# Vivado block design dpss_vck190_pt, xcvc1902-vsva2197-2MP-e-S, Vivado 2023.2
# (continued, part 2 of 3)
current_bd_instance /dp_rx_hier_0

create_bd_cell -type ip -vlnv xilinx.com:ip:axi_gpio:2.0 axi_gpio_0
set_property -dict {CONFIG.C_ALL_OUTPUTS 1 CONFIG.C_GPIO_WIDTH 2} [get_bd_cells axi_gpio_0]
create_bd_cell -type ip -vlnv xilinx.com:ip:axis_data_fifo:2.0 axis_data_fifo_0
create_bd_cell -type ip -vlnv xilinx.com:ip:axis_switch:1.1 axis_switch_0
set_property -dict {CONFIG.DECODER_REG 1 CONFIG.NUM_MI 2 CONFIG.NUM_SI 1 CONFIG.ROUTING_MODE 1} [get_bd_cells axis_switch_0]
create_bd_cell -type ip -vlnv xilinx.com:ip:i2s_transmitter:1.0 i2s_transmitter_0
set_property -dict {CONFIG.C_DEPTH 1024 CONFIG.C_ENABLE_FIFO_COUNT true} [get_bd_cells i2s_transmitter_0]
create_bd_cell -type ip -vlnv xilinx.com:ip:proc_sys_reset:5.0 proc_sys_reset_0
create_bd_cell -type ip -vlnv xilinx.com:ip:proc_sys_reset:5.0 proc_sys_reset_1
create_bd_cell -type ip -vlnv xilinx.com:ip:proc_sys_reset:5.0 proc_sys_reset_2
create_bd_cell -type ip -vlnv xilinx.com:ip:proc_sys_reset:5.0 proc_sys_reset_3
create_bd_cell -type ip -vlnv xilinx.com:ip:proc_sys_reset:5.0 proc_sys_reset_4
create_bd_cell -type ip -vlnv xilinx.com:ip:audio_clock_recovery_unit:1.0 rx_acr
create_bd_cell -type ip -vlnv xilinx.com:ip:smartconnect:1.0 smartconnect_0
set_property -dict {CONFIG.NUM_CLKS 2 CONFIG.NUM_MI 8 CONFIG.NUM_SI 1} [get_bd_cells smartconnect_0]
create_bd_cell -type ip -vlnv xilinx.com:ip:util_reduced_logic:2.0 util_reduced_logic_0
set_property -dict {CONFIG.C_SIZE 2} [get_bd_cells util_reduced_logic_0]
create_bd_cell -type ip -vlnv xilinx.com:ip:util_vector_logic:2.0 util_vector_logic_1
set_property -dict {CONFIG.C_OPERATION not CONFIG.C_SIZE 1} [get_bd_cells util_vector_logic_1]
create_bd_cell -type ip -vlnv xilinx.com:ip:v_frmbuf_wr:2.5 v_frmbuf_wr_0
set_property -dict [list \
  CONFIG.AXIMM_DATA_WIDTH 256 \
  CONFIG.AXIMM_NUM_OUTSTANDING 8 \
  CONFIG.C_M_AXI_MM_VIDEO_DATA_WIDTH 256 \
  CONFIG.HAS_RGBX10 1 \
  CONFIG.HAS_YUV8 1 \
  CONFIG.HAS_YUVX8 0 \
  CONFIG.HAS_YUVX10 1 \
  CONFIG.HAS_YUYV8 1 \
  CONFIG.HAS_Y_UV10 1 \
  CONFIG.MAX_COLS 7680 \
  CONFIG.MAX_DATA_WIDTH 10 \
  CONFIG.MAX_NR_PLANES 2 \
  CONFIG.MAX_ROWS 4320 \
  CONFIG.SAMPLES_PER_CLOCK 4 \
] [get_bd_cells v_frmbuf_wr_0]
create_bd_cell -type ip -vlnv xilinx.com:ip:vid_edid:1.0 vid_edid_0
create_bd_cell -type ip -vlnv xilinx.com:ip:video_frame_crc:1.0 video_frame_crc_0
set_property -dict {CONFIG.BPC 10} [get_bd_cells video_frame_crc_0]
create_bd_cell -type ip -vlnv xilinx.com:ip:xlconcat:2.1 xlconcat_0
create_bd_cell -type ip -vlnv xilinx.com:ip:xlslice:1.0 xlslice_0
set_property -dict {CONFIG.DIN_FROM 0 CONFIG.DIN_TO 0 CONFIG.DIN_WIDTH 2} [get_bd_cells xlslice_0]
create_bd_cell -type ip -vlnv xilinx.com:ip:xlslice:1.0 xlslice_1
set_property -dict {CONFIG.DIN_FROM 1 CONFIG.DIN_TO 1 CONFIG.DIN_WIDTH 2 CONFIG.DOUT_WIDTH 1} [get_bd_cells xlslice_1]
create_bd_cell -type ip -vlnv xilinx.com:ip:xlslice:1.0 xlslice_2
set_property -dict {CONFIG.DIN_FROM 11 CONFIG.DIN_TO 0 CONFIG.DIN_WIDTH 16 CONFIG.DOUT_WIDTH 12} [get_bd_cells xlslice_2]
create_bd_cell -type ip -vlnv xilinx.com:ip:xlslice:1.0 xlslice_3
set_property -dict {CONFIG.DIN_FROM 19 CONFIG.DIN_TO 0 CONFIG.DIN_WIDTH 24 CONFIG.DOUT_WIDTH 20} [get_bd_cells xlslice_3]
create_bd_cell -type ip -vlnv xilinx.com:ip:xlslice:1.0 xlslice_4
set_property -dict {CONFIG.DIN_FROM 19 CONFIG.DIN_TO 0 CONFIG.DIN_WIDTH 24 CONFIG.DOUT_WIDTH 20} [get_bd_cells xlslice_4]
create_bd_cell -type ip -vlnv xilinx.com:ip:v_vid_gt_bridge:2.0 dprx_gt_ip0
set_property -dict [list \
  CONFIG.c_enable_rx 1 \
  CONFIG.c_enable_tx 0 \
  CONFIG.c_new_dp 1 \
  CONFIG.c_protocol 0 \
  CONFIG.c_rx_num_ch 4 \
  CONFIG.c_rx_rate 8.1 \
] [get_bd_cells dprx_gt_ip0]
create_bd_cell -type ip -vlnv xilinx.com:ip:v_dp_rxss1:3.1 v_dp_rxss1_0
set_property -dict [list \
  CONFIG.AUDIO_ENABLE 1 \
  CONFIG.AUX_IO_LOC 1 \
  CONFIG.BITS_PER_COLOR 10 \
  CONFIG.C_LINK_RATE 30 \
  CONFIG.ENABLE_8B10B_DEC 1 \
  CONFIG.INCLUDE_AXI_IIC 0 \
  CONFIG.INCLUDE_CLK_WIZ 1 \
  CONFIG.LINK_RATE 8.1 \
] [get_bd_cells v_dp_rxss1_0]

# ---- hierarchy /dp_tx_hier_0 ----
current_bd_instance /dp_tx_hier_0
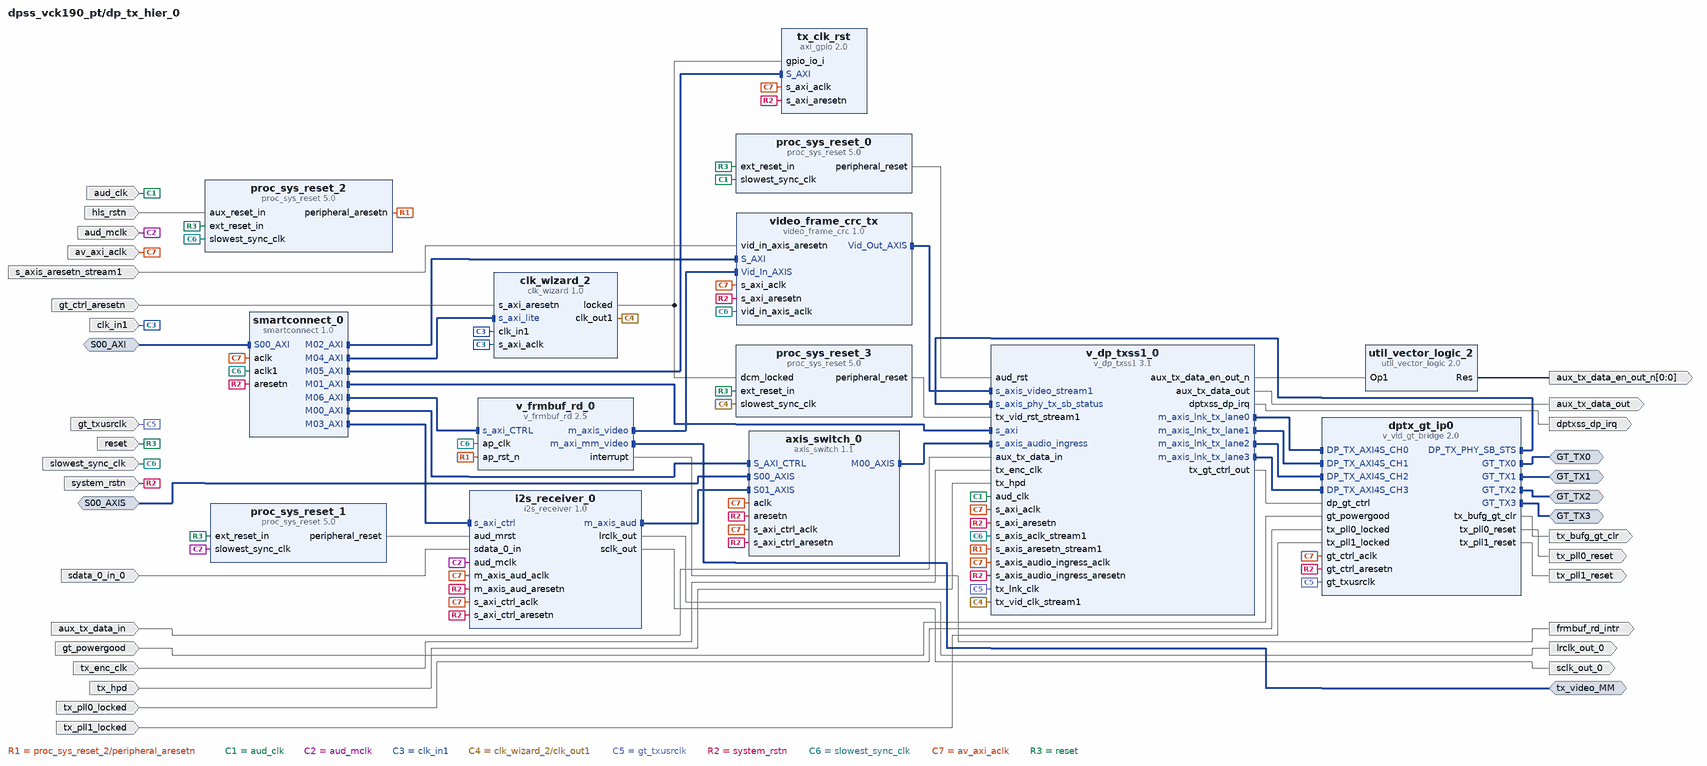
[diagram p3: block diagram inside /dp_tx_hier_0]
create_bd_intf_pin -mode Slave -vlnv xilinx.com:interface:aximm_rtl:1.0 S00_AXI
create_bd_intf_pin -mode Slave -vlnv xilinx.com:interface:axis_rtl:1.0 S00_AXIS
create_bd_intf_pin -mode Master -vlnv xilinx.com:interface:aximm_rtl:1.0 tx_video_MM
create_bd_intf_pin -mode Master -vlnv xilinx.com:interface:gt_tx_interface_rtl:1.0 GT_TX3
create_bd_intf_pin -mode Master -vlnv xilinx.com:interface:gt_tx_interface_rtl:1.0 GT_TX1
create_bd_intf_pin -mode Master -vlnv xilinx.com:interface:gt_tx_interface_rtl:1.0 GT_TX0
create_bd_intf_pin -mode Master -vlnv xilinx.com:interface:gt_tx_interface_rtl:1.0 GT_TX2
create_bd_pin -dir I -type clk aud_clk
create_bd_pin -dir I -type clk aud_mclk
create_bd_pin -dir O -from 0 -to 0 aux_tx_data_en_out_n
create_bd_pin -dir I aux_tx_data_in
create_bd_pin -dir O aux_tx_data_out
create_bd_pin -dir I -type clk av_axi_aclk
create_bd_pin -dir I -type clk clk_in1
create_bd_pin -dir O -type intr dptxss_dp_irq
create_bd_pin -dir O -type intr frmbuf_rd_intr
create_bd_pin -dir I -type rst gt_ctrl_aresetn
create_bd_pin -dir I -type rst hls_rstn
create_bd_pin -dir O lrclk_out_0
create_bd_pin -dir I -type rst reset
create_bd_pin -dir I -type rst s_axis_aresetn_stream1
create_bd_pin -dir O sclk_out_0
create_bd_pin -dir I sdata_0_in_0
create_bd_pin -dir I -type clk slowest_sync_clk
create_bd_pin -dir I -type rst system_rstn
create_bd_pin -dir I -type data tx_hpd
create_bd_pin -dir I tx_pll0_locked
create_bd_pin -dir I gt_powergood
create_bd_pin -dir I -type gt_usrclk gt_txusrclk
create_bd_pin -dir O -type rst tx_pll0_reset
create_bd_pin -dir I tx_pll1_locked
create_bd_pin -dir O tx_bufg_gt_clr
create_bd_pin -dir O -type rst tx_pll1_reset
create_bd_pin -dir I -type clk tx_enc_clk

create_bd_cell -type ip -vlnv xilinx.com:ip:axis_switch:1.1 axis_switch_0
set_property -dict {CONFIG.ROUTING_MODE 1} [get_bd_cells axis_switch_0]
create_bd_cell -type ip -vlnv xilinx.com:ip:clk_wizard:1.0 clk_wizard_2
set_property -dict [list \
  CONFIG.CLKOUT_DRIVES BUFG,BUFG,BUFG,BUFG,BUFG,BUFG,BUFG \
  CONFIG.CLKOUT_DYN_PS None,None,None,None,None,None,None \
  CONFIG.CLKOUT_GROUPING Auto,Auto,Auto,Auto,Auto,Auto,Auto \
  CONFIG.CLKOUT_MATCHED_ROUTING false,false,false,false,false,false,false \
  CONFIG.CLKOUT_MBUFGCE_MODE PERFORMANCE,PERFORMANCE,PERFORMANCE,PERFORMANCE,PERFORMANCE,PERFORMANCE,PERFORMANCE \
  CONFIG.CLKOUT_PORT clk_out1,clk_out2,clk_out3,clk_out4,clk_out5,clk_out6,clk_out7 \
  CONFIG.CLKOUT_REQUESTED_DUTY_CYCLE 50.000,50.000,50.000,50.000,50.000,50.000,50.000 \
  CONFIG.CLKOUT_REQUESTED_OUT_FREQUENCY 300,100.000,100.000,100.000,100.000,100.000,100.000 \
  CONFIG.CLKOUT_REQUESTED_PHASE 0.000,0.000,0.000,0.000,0.000,0.000,0.000 \
  CONFIG.CLKOUT_USED true,false,false,false,false,false,false \
  CONFIG.PRIM_SOURCE No_buffer \
  CONFIG.USE_DYN_RECONFIG true \
] [get_bd_cells clk_wizard_2]
create_bd_cell -type ip -vlnv xilinx.com:ip:i2s_receiver:1.0 i2s_receiver_0
create_bd_cell -type ip -vlnv xilinx.com:ip:proc_sys_reset:5.0 proc_sys_reset_0
create_bd_cell -type ip -vlnv xilinx.com:ip:proc_sys_reset:5.0 proc_sys_reset_1
create_bd_cell -type ip -vlnv xilinx.com:ip:proc_sys_reset:5.0 proc_sys_reset_2
create_bd_cell -type ip -vlnv xilinx.com:ip:proc_sys_reset:5.0 proc_sys_reset_3
create_bd_cell -type ip -vlnv xilinx.com:ip:smartconnect:1.0 smartconnect_0
set_property -dict {CONFIG.NUM_CLKS 2 CONFIG.NUM_MI 7 CONFIG.NUM_SI 1} [get_bd_cells smartconnect_0]
create_bd_cell -type ip -vlnv xilinx.com:ip:axi_gpio:2.0 tx_clk_rst
set_property -dict [list \
  CONFIG.C_ALL_INPUTS 1 \
  CONFIG.C_ALL_OUTPUTS_2 1 \
  CONFIG.C_DOUT_DEFAULT_2 0x0000000f \
  CONFIG.C_GPIO2_WIDTH 1 \
  CONFIG.C_GPIO_WIDTH 1 \
  CONFIG.C_IS_DUAL 1 \
] [get_bd_cells tx_clk_rst]
create_bd_cell -type ip -vlnv xilinx.com:ip:util_vector_logic:2.0 util_vector_logic_2
set_property -dict {CONFIG.C_OPERATION not CONFIG.C_SIZE 1} [get_bd_cells util_vector_logic_2]
create_bd_cell -type ip -vlnv xilinx.com:ip:v_frmbuf_rd:2.5 v_frmbuf_rd_0
set_property -dict [list \
  CONFIG.AXIMM_DATA_WIDTH 256 \
  CONFIG.AXIMM_NUM_OUTSTANDING 8 \
  CONFIG.C_M_AXI_MM_VIDEO_DATA_WIDTH 256 \
  CONFIG.HAS_RGBX10 1 \
  CONFIG.HAS_YUV8 1 \
  CONFIG.HAS_YUVX8 0 \
  CONFIG.HAS_YUVX10 1 \
  CONFIG.HAS_YUYV8 1 \
  CONFIG.HAS_Y_UV10 1 \
  CONFIG.MAX_COLS 7680 \
  CONFIG.MAX_DATA_WIDTH 10 \
  CONFIG.MAX_NR_PLANES 2 \
  CONFIG.MAX_ROWS 4320 \
  CONFIG.SAMPLES_PER_CLOCK 4 \
] [get_bd_cells v_frmbuf_rd_0]
create_bd_cell -type ip -vlnv xilinx.com:ip:video_frame_crc:1.0 video_frame_crc_tx
set_property -dict {CONFIG.BPC 10} [get_bd_cells video_frame_crc_tx]
create_bd_cell -type ip -vlnv xilinx.com:ip:v_vid_gt_bridge:2.0 dptx_gt_ip0
set_property -dict [list \
  CONFIG.c_enable_tx 1 \
  CONFIG.c_new_dp 1 \
  CONFIG.c_protocol 0 \
  CONFIG.c_tx_num_ch 4 \
  CONFIG.c_tx_rate 8.1 \
] [get_bd_cells dptx_gt_ip0]
create_bd_cell -type ip -vlnv xilinx.com:ip:v_dp_txss1:3.1 v_dp_txss1_0
set_property -dict [list \
  CONFIG.AUDIO_ENABLE 1 \
  CONFIG.AUX_IO_LOC 1 \
  CONFIG.BITS_PER_COLOR 10 \
  CONFIG.C_LINK_RATE 30 \
  CONFIG.ENABLE_8B10B_ENC 1 \
  CONFIG.LINK_RATE 8.1 \
] [get_bd_cells v_dp_txss1_0]

# ---- hierarchy /processor_hier_0 ----
current_bd_instance /processor_hier_0
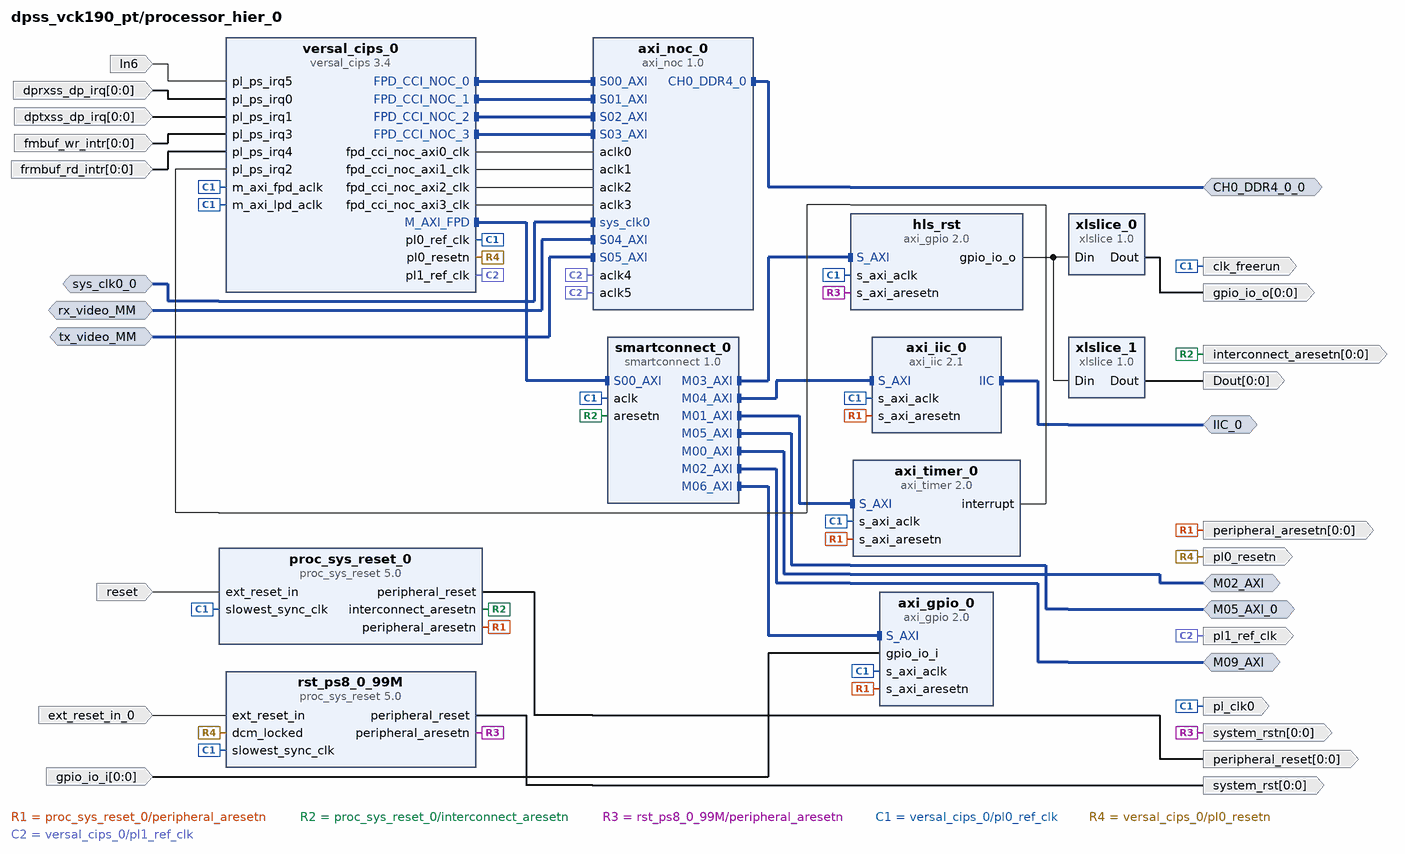
[diagram p4: block diagram inside /processor_hier_0]
create_bd_intf_pin -mode Master -vlnv xilinx.com:interface:ddr4_rtl:1.0 CH0_DDR4_0_0
create_bd_intf_pin -mode Master -vlnv xilinx.com:interface:iic_rtl:1.0 IIC_0
create_bd_intf_pin -mode Master -vlnv xilinx.com:interface:aximm_rtl:1.0 M02_AXI
create_bd_intf_pin -mode Master -vlnv xilinx.com:interface:aximm_rtl:1.0 M05_AXI_0
create_bd_intf_pin -mode Master -vlnv xilinx.com:interface:aximm_rtl:1.0 M09_AXI
create_bd_intf_pin -mode Slave -vlnv xilinx.com:interface:aximm_rtl:1.0 rx_video_MM
create_bd_intf_pin -mode Slave -vlnv xilinx.com:interface:diff_clock_rtl:1.0 sys_clk0_0
create_bd_intf_pin -mode Slave -vlnv xilinx.com:interface:aximm_rtl:1.0 tx_video_MM
create_bd_pin -dir O -from 0 -to 0 Dout
create_bd_pin -dir I -type intr In6
create_bd_pin -dir O -type clk clk_freerun
create_bd_pin -dir I -from 0 -to 0 dprxss_dp_irq
create_bd_pin -dir I -from 0 -to 0 dptxss_dp_irq
create_bd_pin -dir I -type rst ext_reset_in_0
create_bd_pin -dir I -from 0 -to 0 fmbuf_wr_intr
create_bd_pin -dir I -from 0 -to 0 frmbuf_rd_intr
create_bd_pin -dir O -from 0 -to 0 gpio_io_o
create_bd_pin -dir O -from 0 -to 0 -type rst interconnect_aresetn
create_bd_pin -dir O -from 0 -to 0 -type rst peripheral_aresetn
create_bd_pin -dir O -from 0 -to 0 -type rst peripheral_reset
create_bd_pin -dir O -type rst pl0_resetn
create_bd_pin -dir O -type clk pl1_ref_clk
create_bd_pin -dir O -type clk pl_clk0
create_bd_pin -dir I -type rst reset
create_bd_pin -dir O -from 0 -to 0 -type rst system_rst
create_bd_pin -dir O -from 0 -to 0 -type rst system_rstn
create_bd_pin -dir I -from 0 -to 0 gpio_io_i

create_bd_cell -type ip -vlnv xilinx.com:ip:axi_iic:2.1 axi_iic_0
create_bd_cell -type ip -vlnv xilinx.com:ip:axi_noc:1.0 axi_noc_0
set_property -dict [list \
  CONFIG.CH0_DDR4_0_BOARD_INTERFACE ddr4_dimm1 \
  CONFIG.MC_SYSTEM_CLOCK Differential \
  CONFIG.NUM_CLKS 6 \
  CONFIG.NUM_MC 1 \
  CONFIG.NUM_MCP 4 \
  CONFIG.NUM_MI 0 \
  CONFIG.NUM_SI 6 \
  CONFIG.sys_clk0_BOARD_INTERFACE ddr4_dimm1_sma_clk \
] [get_bd_cells axi_noc_0]
create_bd_cell -type ip -vlnv xilinx.com:ip:axi_timer:2.0 axi_timer_0
create_bd_cell -type ip -vlnv xilinx.com:ip:axi_gpio:2.0 hls_rst
set_property -dict {CONFIG.C_ALL_OUTPUTS 1 CONFIG.C_DOUT_DEFAULT 0x0000000f CONFIG.C_GPIO_WIDTH 2} [get_bd_cells hls_rst]
create_bd_cell -type ip -vlnv xilinx.com:ip:proc_sys_reset:5.0 proc_sys_reset_0
create_bd_cell -type ip -vlnv xilinx.com:ip:proc_sys_reset:5.0 rst_ps8_0_99M
create_bd_cell -type ip -vlnv xilinx.com:ip:smartconnect:1.0 smartconnect_0
set_property -dict {CONFIG.NUM_MI 7 CONFIG.NUM_SI 1} [get_bd_cells smartconnect_0]
create_bd_cell -type ip -vlnv xilinx.com:ip:versal_cips:3.4 versal_cips_0
set_property -dict [list \
  CONFIG.CLOCK_MODE Custom \
  CONFIG.DDR_MEMORY_MODE Custom \
  CONFIG.IO_CONFIG_MODE Custom \
  CONFIG.PS_PL_CONNECTIVITY_MODE Custom \
  CONFIG.PS_PMC_CONFIG {['CLOCK_MODE Custom', 'DDR_MEMORY_MODE Custom', 'IO_CONFIG_MODE Custom', 'PMC_CRP_PL0_REF_CTRL_FREQMHZ 100', 'PMC_CRP_PL1_REF_CTRL_FREQMHZ 300', 'PMC_GPIO_EMIO_PERIPHERAL_ENABLE 0', 'PMC_GPIO_EMIO_WIDTH 64', 'PMC_MIO37 {{AUX_IO 0} {DIRECTION out} {DRIVE_STRENGTH 8mA} {OUTPUT_DATA high} {PULL pullup} {SCHMITT 0} {SLEW slow} {USAGE GPIO}}', 'PS_I2C0_PERIPHERAL {{ENABLE 1} {IO {PMC_MIO 46 .. 47}}}', 'PS_I2C1_PERIPHERAL {{ENABLE 1} {IO {PMC_MIO 44 .. 45}}}', 'PS_IRQ_USAGE {{CH0 1} {CH1 1} {CH10 0} {CH11 0} {CH12 0} {CH13 0} {CH14 0} {CH15 0} {CH2 1} {CH3 1} {CH4 1} {CH5 1} {CH6 0} {CH7 0} {CH8 0} {CH9 0}}', 'PS_NUM_FABRIC_RESETS 1', 'PS_PL_CONNECTIVITY_MODE Custom', 'PS_UART0_PERIPHERAL {{ENABLE 1} {IO {PMC_MIO 42 .. 43}}}', 'PS_USE_FPD_CCI_NOC 1', 'PS_USE_M_AXI_FPD 1', 'PS_USE_M_AXI_LPD 1', 'PS_USE_PMCPL_CLK0 1', 'PS_USE_PMCPL_CLK1 1', 'PS_USE_S_AXI_FPD 0', 'PS_USE_S_AXI_LPD 0', 'SMON_ALARMS Set_Alarms_On', 'SMON_ENABLE_TEMP_AVERAGING 0', 'SMON_TEMP_AVERAGING_SAMPLES 0']} \
] [get_bd_cells versal_cips_0]
create_bd_cell -type ip -vlnv xilinx.com:ip:xlslice:1.0 xlslice_0
set_property -dict {CONFIG.DIN_FROM 0 CONFIG.DIN_TO 0 CONFIG.DIN_WIDTH 2} [get_bd_cells xlslice_0]
create_bd_cell -type ip -vlnv xilinx.com:ip:xlslice:1.0 xlslice_1
set_property -dict {CONFIG.DIN_FROM 1 CONFIG.DIN_TO 1 CONFIG.DIN_WIDTH 2 CONFIG.DOUT_WIDTH 1} [get_bd_cells xlslice_1]
create_bd_cell -type ip -vlnv xilinx.com:ip:axi_gpio:2.0 axi_gpio_0
set_property -dict {CONFIG.C_ALL_INPUTS 1 CONFIG.C_GPIO_WIDTH 1} [get_bd_cells axi_gpio_0]

# ---- connections ----

current_bd_instance /gt_quad
connect_bd_intf_net [get_bd_intf_pins gt_quad_base/AXI_LITE] [get_bd_intf_pins AXI_LITE]
connect_bd_intf_net -intf_net dprx_gt_ip0_GT_RX0 [get_bd_intf_pins RX0_GT_IP_Interface] [get_bd_intf_pins gt_quad_base/RX0_GT_IP_Interface]
connect_bd_intf_net -intf_net dprx_gt_ip0_GT_RX1 [get_bd_intf_pins RX1_GT_IP_Interface] [get_bd_intf_pins gt_quad_base/RX1_GT_IP_Interface]
connect_bd_intf_net -intf_net dprx_gt_ip0_GT_RX2 [get_bd_intf_pins RX2_GT_IP_Interface] [get_bd_intf_pins gt_quad_base/RX2_GT_IP_Interface]
connect_bd_intf_net -intf_net dprx_gt_ip0_GT_RX3 [get_bd_intf_pins RX3_GT_IP_Interface] [get_bd_intf_pins gt_quad_base/RX3_GT_IP_Interface]
connect_bd_intf_net [get_bd_intf_pins dprx_gt_ip0_diff_gt_ref_clock] [get_bd_intf_pins util_ds_buf/CLK_IN_D]
connect_bd_intf_net -intf_net dptx_gt_ip0_GT_TX0 [get_bd_intf_pins TX0_GT_IP_Interface] [get_bd_intf_pins gt_quad_base/TX0_GT_IP_Interface]
connect_bd_intf_net -intf_net dptx_gt_ip0_GT_TX1 [get_bd_intf_pins TX1_GT_IP_Interface] [get_bd_intf_pins gt_quad_base/TX1_GT_IP_Interface]
connect_bd_intf_net -intf_net dptx_gt_ip0_GT_TX2 [get_bd_intf_pins TX2_GT_IP_Interface] [get_bd_intf_pins gt_quad_base/TX2_GT_IP_Interface]
connect_bd_intf_net -intf_net dptx_gt_ip0_GT_TX3 [get_bd_intf_pins TX3_GT_IP_Interface] [get_bd_intf_pins gt_quad_base/TX3_GT_IP_Interface]
connect_bd_intf_net [get_bd_intf_pins GT_Serial] [get_bd_intf_pins gt_quad_base/GT_Serial]
connect_bd_net [get_bd_pins bufg_gt_1/usrclk] \
  [get_bd_pins usrclk] [get_bd_pins gt_quad_base/ch1_txusrclk] [get_bd_pins gt_quad_base/ch2_txusrclk] \
  [get_bd_pins gt_quad_base/ch3_txusrclk] [get_bd_pins gt_quad_base/ch0_txusrclk]
connect_bd_net [get_bd_pins bufg_gt/usrclk] \
  [get_bd_pins ch0_rxusrclk] [get_bd_pins gt_quad_base/ch0_rxusrclk] [get_bd_pins gt_quad_base/ch1_rxusrclk] \
  [get_bd_pins gt_quad_base/ch2_rxusrclk] [get_bd_pins gt_quad_base/ch3_rxusrclk]
connect_bd_net -net dprx_gt_ip0_rx_bufg_gt_clr [get_bd_pins gt_bufgtclr] [get_bd_pins bufg_gt/gt_bufgtclr]
connect_bd_net -net dprx_gt_ip0_rx_pll0_reset [get_bd_pins hsclk0_lcpllreset] [get_bd_pins gt_quad_base/hsclk0_lcpllreset]
connect_bd_net -net dprx_gt_ip0_rx_pll1_reset [get_bd_pins hsclk1_lcpllreset] [get_bd_pins gt_quad_base/hsclk1_lcpllreset]
connect_bd_net [get_bd_pins dptx_bufg_gt1/usrclk] [get_bd_pins usrclk1]
connect_bd_net -net dptx_gt_ip0_tx_bufg_gt_clr [get_bd_pins gt_bufgtclr1] [get_bd_pins dptx_bufg_gt1/gt_bufgtclr] [get_bd_pins bufg_gt_1/gt_bufgtclr]
connect_bd_net -net dptx_gt_ip0_tx_pll0_reset [get_bd_pins hsclk0_rpllreset] [get_bd_pins gt_quad_base/hsclk0_rpllreset]
connect_bd_net -net dptx_gt_ip0_tx_pll1_reset [get_bd_pins hsclk1_rpllreset] [get_bd_pins gt_quad_base/hsclk1_rpllreset]
connect_bd_net [get_bd_pins gt_quad_base/ch0_rxoutclk] [get_bd_pins bufg_gt/outclk]
connect_bd_net [get_bd_pins gt_quad_base/ch0_txoutclk] [get_bd_pins bufg_gt_1/outclk]
connect_bd_net [get_bd_pins gt_quad_base/ch1_txoutclk] [get_bd_pins dptx_bufg_gt1/outclk]
connect_bd_net [get_bd_pins gt_quad_base/gtpowergood] [get_bd_pins gtpowergood]
connect_bd_net [get_bd_pins gt_quad_base/hsclk0_lcplllock] [get_bd_pins hsclk0_lcplllock]
connect_bd_net [get_bd_pins gt_quad_base/hsclk0_rplllock] [get_bd_pins hsclk0_rplllock]
connect_bd_net [get_bd_pins gt_quad_base/hsclk1_lcplllock] [get_bd_pins hsclk1_lcplllock]
connect_bd_net [get_bd_pins gt_quad_base/hsclk1_rplllock] [get_bd_pins hsclk1_rplllock]
connect_bd_net [get_bd_pins s_axi_lite_clk] [get_bd_pins gt_quad_base/s_axi_lite_clk]
connect_bd_net [get_bd_pins s_axi_lite_resetn] [get_bd_pins gt_quad_base/s_axi_lite_resetn]
connect_bd_net [get_bd_pins util_ds_buf/IBUF_OUT] [get_bd_pins gt_quad_base/GT_REFCLK0] [get_bd_pins gt_quad_base/GT_REFCLK1]

current_bd_instance /dp_rx_hier_0
connect_bd_intf_net [get_bd_intf_pins dprx_gt_ip0/GT_RX3] [get_bd_intf_pins GT_RX3]
connect_bd_intf_net [get_bd_intf_pins dprx_gt_ip0/GT_RX0] [get_bd_intf_pins GT_RX0]
connect_bd_intf_net [get_bd_intf_pins dprx_gt_ip0/GT_RX1] [get_bd_intf_pins GT_RX1]
connect_bd_intf_net [get_bd_intf_pins dprx_gt_ip0/GT_RX2] [get_bd_intf_pins GT_RX2]
connect_bd_intf_net [get_bd_intf_pins S00_AXI] [get_bd_intf_pins smartconnect_0/S00_AXI]
connect_bd_intf_net [get_bd_intf_pins M_AXIS] [get_bd_intf_pins axis_data_fifo_0/M_AXIS]
connect_bd_intf_net [get_bd_intf_pins axis_data_fifo_0/S_AXIS] [get_bd_intf_pins axis_switch_0/M00_AXIS]
connect_bd_intf_net [get_bd_intf_pins axis_switch_0/M01_AXIS] [get_bd_intf_pins i2s_transmitter_0/s_axis_aud]
connect_bd_intf_net [get_bd_intf_pins dprx_gt_ip0/DP_RX_AXI4S_CH0] [get_bd_intf_pins v_dp_rxss1_0/s_axis_lnk_rx_lane0]
connect_bd_intf_net [get_bd_intf_pins dprx_gt_ip0/DP_RX_AXI4S_CH1] [get_bd_intf_pins v_dp_rxss1_0/s_axis_lnk_rx_lane1]
connect_bd_intf_net [get_bd_intf_pins dprx_gt_ip0/DP_RX_AXI4S_CH2] [get_bd_intf_pins v_dp_rxss1_0/s_axis_lnk_rx_lane2]
connect_bd_intf_net [get_bd_intf_pins dprx_gt_ip0/DP_RX_AXI4S_CH3] [get_bd_intf_pins v_dp_rxss1_0/s_axis_lnk_rx_lane3]
connect_bd_intf_net [get_bd_intf_pins dprx_gt_ip0/DP_RX_PHY_SB_STS] [get_bd_intf_pins v_dp_rxss1_0/s_axis_phy_rx_sb_status]
connect_bd_intf_net [get_bd_intf_pins smartconnect_0/M00_AXI] [get_bd_intf_pins v_dp_rxss1_0/s_axi]
connect_bd_intf_net [get_bd_intf_pins smartconnect_0/M01_AXI] [get_bd_intf_pins video_frame_crc_0/S_AXI]
connect_bd_intf_net [get_bd_intf_pins rx_acr/s_axi_ctrl] [get_bd_intf_pins smartconnect_0/M02_AXI]
connect_bd_intf_net [get_bd_intf_pins smartconnect_0/M03_AXI] [get_bd_intf_pins vid_edid_0/s_axi]
connect_bd_intf_net [get_bd_intf_pins axi_gpio_0/S_AXI] [get_bd_intf_pins smartconnect_0/M04_AXI]
connect_bd_intf_net [get_bd_intf_pins axis_switch_0/S_AXI_CTRL] [get_bd_intf_pins smartconnect_0/M05_AXI]
connect_bd_intf_net [get_bd_intf_pins i2s_transmitter_0/s_axi_ctrl] [get_bd_intf_pins smartconnect_0/M06_AXI]
connect_bd_intf_net [get_bd_intf_pins smartconnect_0/M07_AXI] [get_bd_intf_pins v_frmbuf_wr_0/s_axi_CTRL]
connect_bd_intf_net [get_bd_intf_pins v_dp_rxss1_0/aud_axi_egress] [get_bd_intf_pins axis_switch_0/S00_AXIS]
connect_bd_intf_net [get_bd_intf_pins dprx_gt_ip0/DP_RX_PHY_SB_CTRL] [get_bd_intf_pins v_dp_rxss1_0/m_axis_phy_rx_sb_control]
connect_bd_intf_net [get_bd_intf_pins video_frame_crc_0/Vid_In_AXIS] [get_bd_intf_pins v_dp_rxss1_0/m_axis_video_stream1]
connect_bd_intf_net [get_bd_intf_pins rx_video_MM] [get_bd_intf_pins v_frmbuf_wr_0/m_axi_mm_video]
connect_bd_intf_net [get_bd_intf_pins v_frmbuf_wr_0/s_axis_video] [get_bd_intf_pins video_frame_crc_0/Vid_Out_AXIS]
connect_bd_net [get_bd_pins v_dp_rxss1_0/edid_iic_sda_t] [get_bd_pins vid_edid_0/iic_sda_in] [get_bd_pins xlconcat_0/In1]
connect_bd_net [get_bd_pins aud_mclk] \
  [get_bd_pins i2s_transmitter_0/aud_mclk] [get_bd_pins proc_sys_reset_3/slowest_sync_clk] \
  [get_bd_pins proc_sys_reset_4/slowest_sync_clk] [get_bd_pins rx_acr/aud_mclk]
connect_bd_net -net aux_reset_in_1 [get_bd_pins hls_rstn] [get_bd_pins proc_sys_reset_1/aux_reset_in]
connect_bd_net -net aux_rx_data_in_0_1 [get_bd_pins aux_rx_data_in_0] [get_bd_pins v_dp_rxss1_0/aux_rx_data_in]
connect_bd_net [get_bd_pins axi_gpio_0/gpio_io_o] [get_bd_pins xlslice_0/Din] [get_bd_pins xlslice_1/Din]
connect_bd_net -net ctl_reset_1 [get_bd_pins system_rst] [get_bd_pins vid_edid_0/ctl_reset]
connect_bd_net -net dcm_locked_0_1 [get_bd_pins dcm_locked_0] [get_bd_pins proc_sys_reset_0/dcm_locked] [get_bd_pins proc_sys_reset_1/dcm_locked]
connect_bd_net [get_bd_pins dprx_gt_ip0/rx_bufg_gt_clr] [get_bd_pins rx_bufg_gt_clr]
connect_bd_net [get_bd_pins dprx_gt_ip0/rx_pll0_reset] [get_bd_pins rx_pll0_reset]
connect_bd_net [get_bd_pins dprx_gt_ip0/rx_pll1_reset] [get_bd_pins rx_pll1_reset]
connect_bd_net [get_bd_pins ext_reset_in_0] \
  [get_bd_pins proc_sys_reset_0/ext_reset_in] [get_bd_pins proc_sys_reset_1/ext_reset_in] \
  [get_bd_pins proc_sys_reset_2/ext_reset_in] [get_bd_pins proc_sys_reset_3/ext_reset_in] \
  [get_bd_pins proc_sys_reset_4/ext_reset_in]
connect_bd_net [get_bd_pins gt_powergood] [get_bd_pins dprx_gt_ip0/gt_powergood]
connect_bd_net [get_bd_pins gt_rxusrclk] [get_bd_pins dprx_gt_ip0/gt_rxusrclk] [get_bd_pins v_dp_rxss1_0/rx_lnk_clk]
connect_bd_net [get_bd_pins i2s_transmitter_0/fifo_rdata_count] [get_bd_pins xlslice_2/Din]
connect_bd_net [get_bd_pins i2s_transmitter_0/irq] [get_bd_pins irq]
connect_bd_net [get_bd_pins i2s_transmitter_0/lrclk_out] [get_bd_pins lrclk_out_0]
connect_bd_net [get_bd_pins i2s_transmitter_0/sclk_out] [get_bd_pins sclk_out_0]
connect_bd_net [get_bd_pins i2s_transmitter_0/sdata_0_out] [get_bd_pins sdata_0_out_0]
connect_bd_net [get_bd_pins proc_sys_reset_0/peripheral_aresetn] [get_bd_pins peripheral_aresetn1] [get_bd_pins video_frame_crc_0/vid_in_axis_aresetn]
connect_bd_net [get_bd_pins proc_sys_reset_0/peripheral_reset] [get_bd_pins v_dp_rxss1_0/rx_vid_rst]
connect_bd_net [get_bd_pins proc_sys_reset_1/peripheral_aresetn] [get_bd_pins v_frmbuf_wr_0/ap_rst_n]
connect_bd_net [get_bd_pins proc_sys_reset_2/peripheral_aresetn] [get_bd_pins rx_acr/acr_resetn] [get_bd_pins rx_acr/ref_clk_resetn]
connect_bd_net [get_bd_pins proc_sys_reset_3/peripheral_reset] [get_bd_pins rx_acr/aud_mrst]
connect_bd_net [get_bd_pins proc_sys_reset_4/peripheral_reset] [get_bd_pins i2s_transmitter_0/aud_mrst]
connect_bd_net [get_bd_pins rx_acr/aud_clk_out] [get_bd_pins aud_clk_out_0]
connect_bd_net [get_bd_pins rx_pll0_locked] [get_bd_pins dprx_gt_ip0/rx_pll0_locked]
connect_bd_net -net rx_pll1_locked1_1 [get_bd_pins rx_pll1_locked1] [get_bd_pins dprx_gt_ip0/rx_pll1_locked]
connect_bd_net [get_bd_pins util_reduced_logic_0/Res] [get_bd_pins v_dp_rxss1_0/edid_iic_sda_i]
connect_bd_net [get_bd_pins util_vector_logic_1/Res] [get_bd_pins aux_rx_data_en_out_n_0]
connect_bd_net [get_bd_pins v_dp_rxss1_0/acr_m_aud] [get_bd_pins xlslice_3/Din]
connect_bd_net [get_bd_pins v_dp_rxss1_0/acr_n_aud] [get_bd_pins xlslice_4/Din]
connect_bd_net [get_bd_pins v_dp_rxss1_0/acr_valid] [get_bd_pins rx_acr/acr_valid_in]
connect_bd_net [get_bd_pins v_dp_rxss1_0/aux_rx_data_en_out_n] [get_bd_pins util_vector_logic_1/Op1]
connect_bd_net [get_bd_pins v_dp_rxss1_0/aux_rx_data_out] [get_bd_pins aux_rx_data_out_0]
connect_bd_net [get_bd_pins v_dp_rxss1_0/clkwiz_rx_locked_out] [get_bd_pins dprx_gt_ip0/rx_mmcm_locked]
connect_bd_net [get_bd_pins v_dp_rxss1_0/dprxss_dp_irq] [get_bd_pins dprxss_dp_irq]
connect_bd_net [get_bd_pins v_dp_rxss1_0/edid_iic_scl_t] [get_bd_pins v_dp_rxss1_0/edid_iic_scl_i] [get_bd_pins vid_edid_0/iic_scl_in]
connect_bd_net [get_bd_pins v_dp_rxss1_0/rx_dec_clk_out] \
  [get_bd_pins proc_sys_reset_2/slowest_sync_clk] [get_bd_pins rx_acr/ref_clk] [get_bd_pins rx_acr/acr_clk]
connect_bd_net [get_bd_pins v_dp_rxss1_0/rx_gt_ctrl_out] [get_bd_pins dprx_gt_ip0/dp_gt_ctrl]
connect_bd_net [get_bd_pins v_dp_rxss1_0/rx_hpd] [get_bd_pins rx_hpd]
connect_bd_net [get_bd_pins v_frmbuf_wr_0/interrupt] [get_bd_pins fmbuf_wr_intr]
connect_bd_net [get_bd_pins vid_edid_0/iic_sda_out] [get_bd_pins xlconcat_0/In0]
connect_bd_net -net vid_phy_axi4lite_aresetn_1 [get_bd_pins system_rstn] \
  [get_bd_pins axi_gpio_0/s_axi_aresetn] [get_bd_pins axis_switch_0/aresetn] [get_bd_pins axis_switch_0/s_axi_ctrl_aresetn] \
  [get_bd_pins i2s_transmitter_0/s_axi_ctrl_aresetn] [get_bd_pins i2s_transmitter_0/s_axis_aud_aresetn] \
  [get_bd_pins rx_acr/s_axi_ctrl_aresetn] [get_bd_pins smartconnect_0/aresetn] [get_bd_pins vid_edid_0/s_axi_aresetn] \
  [get_bd_pins video_frame_crc_0/s_axi_aresetn] [get_bd_pins dprx_gt_ip0/gt_ctrl_aresetn] \
  [get_bd_pins v_dp_rxss1_0/s_axi_aresetn] [get_bd_pins v_dp_rxss1_0/m_aud_axis_aresetn]
connect_bd_net [get_bd_pins xlconcat_0/dout] [get_bd_pins util_reduced_logic_0/Op1]
connect_bd_net [get_bd_pins xlslice_0/Dout] [get_bd_pins Dout]
connect_bd_net [get_bd_pins xlslice_1/Dout] [get_bd_pins axis_data_fifo_0/s_axis_aresetn] [get_bd_pins proc_sys_reset_4/aux_reset_in]
connect_bd_net [get_bd_pins xlslice_2/Dout] [get_bd_pins rx_acr/fifo_datacount_in]
connect_bd_net [get_bd_pins xlslice_3/Dout] [get_bd_pins rx_acr/acr_n_in]
connect_bd_net [get_bd_pins xlslice_4/Dout] [get_bd_pins rx_acr/acr_cts_in]
connect_bd_net -net zynq_ultra_ps_e_0_pl_clk0 [get_bd_pins system_clk] \
  [get_bd_pins axi_gpio_0/s_axi_aclk] [get_bd_pins axis_data_fifo_0/s_axis_aclk] [get_bd_pins axis_switch_0/aclk] \
  [get_bd_pins axis_switch_0/s_axi_ctrl_aclk] [get_bd_pins i2s_transmitter_0/s_axi_ctrl_aclk] \
  [get_bd_pins i2s_transmitter_0/s_axis_aud_aclk] [get_bd_pins rx_acr/s_axi_ctrl_aclk] [get_bd_pins smartconnect_0/aclk] \
  [get_bd_pins vid_edid_0/ctl_clk] [get_bd_pins vid_edid_0/s_axi_aclk] [get_bd_pins video_frame_crc_0/s_axi_aclk] \
  [get_bd_pins dprx_gt_ip0/gt_ctrl_aclk] [get_bd_pins v_dp_rxss1_0/s_axi_aclk] [get_bd_pins v_dp_rxss1_0/m_aud_axis_aclk]
connect_bd_net -net zynq_ultra_ps_e_0_pl_clk2 [get_bd_pins video_clk_300] \
  [get_bd_pins proc_sys_reset_0/slowest_sync_clk] [get_bd_pins proc_sys_reset_1/slowest_sync_clk] \
  [get_bd_pins smartconnect_0/aclk1] [get_bd_pins v_frmbuf_wr_0/ap_clk] [get_bd_pins video_frame_crc_0/vid_in_axis_aclk] \
  [get_bd_pins v_dp_rxss1_0/rx_vid_clk] [get_bd_pins v_dp_rxss1_0/m_axis_aclk_stream1]

current_bd_instance /dp_tx_hier_0
connect_bd_intf_net [get_bd_intf_pins dptx_gt_ip0/GT_TX3] [get_bd_intf_pins GT_TX3]
connect_bd_intf_net [get_bd_intf_pins dptx_gt_ip0/GT_TX1] [get_bd_intf_pins GT_TX1]
connect_bd_intf_net [get_bd_intf_pins dptx_gt_ip0/GT_TX0] [get_bd_intf_pins GT_TX0]
connect_bd_intf_net [get_bd_intf_pins dptx_gt_ip0/GT_TX2] [get_bd_intf_pins GT_TX2]
connect_bd_intf_net [get_bd_intf_pins S00_AXIS] [get_bd_intf_pins axis_switch_0/S00_AXIS]
connect_bd_intf_net [get_bd_intf_pins S00_AXI] [get_bd_intf_pins smartconnect_0/S00_AXI]
connect_bd_intf_net [get_bd_intf_pins axis_switch_0/M00_AXIS] [get_bd_intf_pins v_dp_txss1_0/s_axis_audio_ingress]
connect_bd_intf_net [get_bd_intf_pins dptx_gt_ip0/DP_TX_PHY_SB_STS] [get_bd_intf_pins v_dp_txss1_0/s_axis_phy_tx_sb_status]
connect_bd_intf_net [get_bd_intf_pins axis_switch_0/S01_AXIS] [get_bd_intf_pins i2s_receiver_0/m_axis_aud]
connect_bd_intf_net [get_bd_intf_pins axis_switch_0/S_AXI_CTRL] [get_bd_intf_pins smartconnect_0/M00_AXI]
connect_bd_intf_net [get_bd_intf_pins smartconnect_0/M01_AXI] [get_bd_intf_pins v_dp_txss1_0/s_axi]
connect_bd_intf_net [get_bd_intf_pins smartconnect_0/M02_AXI] [get_bd_intf_pins video_frame_crc_tx/S_AXI]
connect_bd_intf_net [get_bd_intf_pins i2s_receiver_0/s_axi_ctrl] [get_bd_intf_pins smartconnect_0/M03_AXI]
connect_bd_intf_net [get_bd_intf_pins smartconnect_0/M04_AXI] [get_bd_intf_pins clk_wizard_2/s_axi_lite]
connect_bd_intf_net [get_bd_intf_pins smartconnect_0/M05_AXI] [get_bd_intf_pins tx_clk_rst/S_AXI]
connect_bd_intf_net [get_bd_intf_pins smartconnect_0/M06_AXI] [get_bd_intf_pins v_frmbuf_rd_0/s_axi_CTRL]
connect_bd_intf_net [get_bd_intf_pins dptx_gt_ip0/DP_TX_AXI4S_CH0] [get_bd_intf_pins v_dp_txss1_0/m_axis_lnk_tx_lane0]
connect_bd_intf_net [get_bd_intf_pins dptx_gt_ip0/DP_TX_AXI4S_CH1] [get_bd_intf_pins v_dp_txss1_0/m_axis_lnk_tx_lane1]
connect_bd_intf_net [get_bd_intf_pins dptx_gt_ip0/DP_TX_AXI4S_CH2] [get_bd_intf_pins v_dp_txss1_0/m_axis_lnk_tx_lane2]
connect_bd_intf_net [get_bd_intf_pins dptx_gt_ip0/DP_TX_AXI4S_CH3] [get_bd_intf_pins v_dp_txss1_0/m_axis_lnk_tx_lane3]
connect_bd_intf_net [get_bd_intf_pins tx_video_MM] [get_bd_intf_pins v_frmbuf_rd_0/m_axi_mm_video]
connect_bd_intf_net [get_bd_intf_pins v_frmbuf_rd_0/m_axis_video] [get_bd_intf_pins video_frame_crc_tx/Vid_In_AXIS]
connect_bd_intf_net [get_bd_intf_pins v_dp_txss1_0/s_axis_video_stream1] [get_bd_intf_pins video_frame_crc_tx/Vid_Out_AXIS]
connect_bd_net -net ap_rst_n_1 [get_bd_pins proc_sys_reset_2/peripheral_aresetn] \
  [get_bd_pins v_frmbuf_rd_0/ap_rst_n] [get_bd_pins v_dp_txss1_0/s_axis_aresetn_stream1]
connect_bd_net [get_bd_pins aud_clk] [get_bd_pins proc_sys_reset_0/slowest_sync_clk] [get_bd_pins v_dp_txss1_0/aud_clk]
connect_bd_net [get_bd_pins aud_mclk] [get_bd_pins i2s_receiver_0/aud_mclk] [get_bd_pins proc_sys_reset_1/slowest_sync_clk]
connect_bd_net [get_bd_pins aux_tx_data_in] [get_bd_pins v_dp_txss1_0/aux_tx_data_in]
connect_bd_net -net clk_in1_1 [get_bd_pins clk_in1] [get_bd_pins clk_wizard_2/clk_in1] [get_bd_pins clk_wizard_2/s_axi_aclk]
connect_bd_net -net clk_wiz_1_clk_out1 [get_bd_pins clk_wizard_2/clk_out1] \
  [get_bd_pins proc_sys_reset_3/slowest_sync_clk] [get_bd_pins v_dp_txss1_0/tx_vid_clk_stream1]
connect_bd_net -net clk_wiz_1_locked [get_bd_pins clk_wizard_2/locked] [get_bd_pins proc_sys_reset_3/dcm_locked] [get_bd_pins tx_clk_rst/gpio_io_i]
connect_bd_net [get_bd_pins dptx_gt_ip0/tx_bufg_gt_clr] [get_bd_pins tx_bufg_gt_clr]
connect_bd_net [get_bd_pins dptx_gt_ip0/tx_pll0_reset] [get_bd_pins tx_pll0_reset]
connect_bd_net [get_bd_pins dptx_gt_ip0/tx_pll1_reset] [get_bd_pins tx_pll1_reset]
connect_bd_net [get_bd_pins gt_ctrl_aresetn] [get_bd_pins clk_wizard_2/s_axi_aresetn]
connect_bd_net [get_bd_pins gt_powergood] [get_bd_pins dptx_gt_ip0/gt_powergood]
connect_bd_net [get_bd_pins gt_txusrclk] [get_bd_pins dptx_gt_ip0/gt_txusrclk] [get_bd_pins v_dp_txss1_0/tx_lnk_clk]
connect_bd_net [get_bd_pins hls_rstn] [get_bd_pins proc_sys_reset_2/aux_reset_in]
connect_bd_net [get_bd_pins i2s_receiver_0/lrclk_out] [get_bd_pins lrclk_out_0]
connect_bd_net [get_bd_pins i2s_receiver_0/sclk_out] [get_bd_pins sclk_out_0]
connect_bd_net [get_bd_pins proc_sys_reset_0/peripheral_reset] [get_bd_pins v_dp_txss1_0/aud_rst]
connect_bd_net [get_bd_pins proc_sys_reset_1/peripheral_reset] [get_bd_pins i2s_receiver_0/aud_mrst]
connect_bd_net [get_bd_pins proc_sys_reset_3/peripheral_reset] [get_bd_pins v_dp_txss1_0/tx_vid_rst_stream1]
connect_bd_net -net rst_ps8_0_99M_peripheral_aresetn [get_bd_pins system_rstn] \
  [get_bd_pins axis_switch_0/aresetn] [get_bd_pins axis_switch_0/s_axi_ctrl_aresetn] \
  [get_bd_pins i2s_receiver_0/m_axis_aud_aresetn] [get_bd_pins i2s_receiver_0/s_axi_ctrl_aresetn] \
  [get_bd_pins smartconnect_0/aresetn] [get_bd_pins tx_clk_rst/s_axi_aresetn] [get_bd_pins video_frame_crc_tx/s_axi_aresetn] \
  [get_bd_pins v_dp_txss1_0/s_axis_audio_ingress_aresetn] [get_bd_pins dptx_gt_ip0/gt_ctrl_aresetn] \
  [get_bd_pins v_dp_txss1_0/s_axi_aresetn]
connect_bd_net -net s_axis_aresetn_stream1_1 [get_bd_pins s_axis_aresetn_stream1] [get_bd_pins video_frame_crc_tx/vid_in_axis_aresetn]
connect_bd_net -net sdata_0_in_0_1 [get_bd_pins sdata_0_in_0] [get_bd_pins i2s_receiver_0/sdata_0_in]
connect_bd_net [get_bd_pins slowest_sync_clk] \
  [get_bd_pins proc_sys_reset_2/slowest_sync_clk] [get_bd_pins smartconnect_0/aclk1] [get_bd_pins v_frmbuf_rd_0/ap_clk] \
  [get_bd_pins video_frame_crc_tx/vid_in_axis_aclk] [get_bd_pins v_dp_txss1_0/s_axis_aclk_stream1]
connect_bd_net [get_bd_pins tx_enc_clk] [get_bd_pins v_dp_txss1_0/tx_enc_clk]
connect_bd_net [get_bd_pins tx_hpd] [get_bd_pins v_dp_txss1_0/tx_hpd]
connect_bd_net [get_bd_pins tx_pll0_locked] [get_bd_pins dptx_gt_ip0/tx_pll0_locked]
connect_bd_net [get_bd_pins tx_pll1_locked] [get_bd_pins dptx_gt_ip0/tx_pll1_locked]
connect_bd_net [get_bd_pins util_vector_logic_2/Res] [get_bd_pins aux_tx_data_en_out_n]
connect_bd_net [get_bd_pins v_dp_txss1_0/aux_tx_data_en_out_n] [get_bd_pins util_vector_logic_2/Op1]
connect_bd_net [get_bd_pins v_dp_txss1_0/aux_tx_data_out] [get_bd_pins aux_tx_data_out]
connect_bd_net [get_bd_pins v_dp_txss1_0/dptxss_dp_irq] [get_bd_pins dptxss_dp_irq]
connect_bd_net [get_bd_pins v_dp_txss1_0/tx_gt_ctrl_out] [get_bd_pins dptx_gt_ip0/dp_gt_ctrl]
connect_bd_net [get_bd_pins v_frmbuf_rd_0/interrupt] [get_bd_pins frmbuf_rd_intr]
connect_bd_net -net zynq_ultra_ps_e_0_pl_clk0 [get_bd_pins av_axi_aclk] \
  [get_bd_pins axis_switch_0/aclk] [get_bd_pins axis_switch_0/s_axi_ctrl_aclk] [get_bd_pins i2s_receiver_0/m_axis_aud_aclk] \
  [get_bd_pins i2s_receiver_0/s_axi_ctrl_aclk] [get_bd_pins smartconnect_0/aclk] [get_bd_pins tx_clk_rst/s_axi_aclk] \
  [get_bd_pins video_frame_crc_tx/s_axi_aclk] [get_bd_pins v_dp_txss1_0/s_axis_audio_ingress_aclk] \
  [get_bd_pins dptx_gt_ip0/gt_ctrl_aclk] [get_bd_pins v_dp_txss1_0/s_axi_aclk]
connect_bd_net -net zynq_ultra_ps_e_0_pl_resetn0 [get_bd_pins reset] \
  [get_bd_pins proc_sys_reset_0/ext_reset_in] [get_bd_pins proc_sys_reset_1/ext_reset_in] \
  [get_bd_pins proc_sys_reset_2/ext_reset_in] [get_bd_pins proc_sys_reset_3/ext_reset_in]

current_bd_instance /processor_hier_0
connect_bd_intf_net [get_bd_intf_pins IIC_0] [get_bd_intf_pins axi_iic_0/IIC]
connect_bd_intf_net [get_bd_intf_pins CH0_DDR4_0_0] [get_bd_intf_pins axi_noc_0/CH0_DDR4_0]
connect_bd_intf_net [get_bd_intf_pins sys_clk0_0] [get_bd_intf_pins axi_noc_0/sys_clk0]
connect_bd_intf_net [get_bd_intf_pins M05_AXI_0] [get_bd_intf_pins smartconnect_0/M05_AXI]
connect_bd_intf_net [get_bd_intf_pins rx_video_MM] [get_bd_intf_pins axi_noc_0/S04_AXI]
connect_bd_intf_net [get_bd_intf_pins M02_AXI] [get_bd_intf_pins smartconnect_0/M00_AXI]
connect_bd_intf_net [get_bd_intf_pins axi_timer_0/S_AXI] [get_bd_intf_pins smartconnect_0/M01_AXI]
connect_bd_intf_net [get_bd_intf_pins M09_AXI] [get_bd_intf_pins smartconnect_0/M02_AXI]
connect_bd_intf_net [get_bd_intf_pins hls_rst/S_AXI] [get_bd_intf_pins smartconnect_0/M03_AXI]
connect_bd_intf_net [get_bd_intf_pins axi_iic_0/S_AXI] [get_bd_intf_pins smartconnect_0/M04_AXI]
connect_bd_intf_net [get_bd_intf_pins smartconnect_0/M06_AXI] [get_bd_intf_pins axi_gpio_0/S_AXI]
connect_bd_intf_net [get_bd_intf_pins tx_video_MM] [get_bd_intf_pins axi_noc_0/S05_AXI]
connect_bd_intf_net [get_bd_intf_pins axi_noc_0/S00_AXI] [get_bd_intf_pins versal_cips_0/FPD_CCI_NOC_0]
connect_bd_intf_net [get_bd_intf_pins axi_noc_0/S01_AXI] [get_bd_intf_pins versal_cips_0/FPD_CCI_NOC_1]
connect_bd_intf_net [get_bd_intf_pins axi_noc_0/S02_AXI] [get_bd_intf_pins versal_cips_0/FPD_CCI_NOC_2]
connect_bd_intf_net [get_bd_intf_pins axi_noc_0/S03_AXI] [get_bd_intf_pins versal_cips_0/FPD_CCI_NOC_3]
connect_bd_intf_net [get_bd_intf_pins smartconnect_0/S00_AXI] [get_bd_intf_pins versal_cips_0/M_AXI_FPD]
connect_bd_net -net In6_1 [get_bd_pins In6] [get_bd_pins versal_cips_0/pl_ps_irq5]
connect_bd_net -net aresetn2_1 [get_bd_pins proc_sys_reset_0/peripheral_aresetn] \
  [get_bd_pins peripheral_aresetn] [get_bd_pins axi_iic_0/s_axi_aresetn] [get_bd_pins axi_timer_0/s_axi_aresetn] \
  [get_bd_pins axi_gpio_0/s_axi_aresetn]
connect_bd_net [get_bd_pins axi_timer_0/interrupt] [get_bd_pins versal_cips_0/pl_ps_irq2]
connect_bd_net [get_bd_pins dprxss_dp_irq] [get_bd_pins versal_cips_0/pl_ps_irq0]
connect_bd_net [get_bd_pins dptxss_dp_irq] [get_bd_pins versal_cips_0/pl_ps_irq1]
connect_bd_net -net ext_reset_in_0_1 [get_bd_pins ext_reset_in_0] [get_bd_pins rst_ps8_0_99M/ext_reset_in]
connect_bd_net [get_bd_pins fmbuf_wr_intr] [get_bd_pins versal_cips_0/pl_ps_irq3]
connect_bd_net [get_bd_pins frmbuf_rd_intr] [get_bd_pins versal_cips_0/pl_ps_irq4]
connect_bd_net [get_bd_pins gpio_io_i] [get_bd_pins axi_gpio_0/gpio_io_i]
connect_bd_net [get_bd_pins hls_rst/gpio_io_o] [get_bd_pins xlslice_0/Din] [get_bd_pins xlslice_1/Din]
connect_bd_net [get_bd_pins proc_sys_reset_0/interconnect_aresetn] [get_bd_pins interconnect_aresetn] [get_bd_pins smartconnect_0/aresetn]
connect_bd_net [get_bd_pins proc_sys_reset_0/peripheral_reset] [get_bd_pins peripheral_reset]
connect_bd_net [get_bd_pins reset] [get_bd_pins proc_sys_reset_0/ext_reset_in]
connect_bd_net [get_bd_pins rst_ps8_0_99M/peripheral_aresetn] [get_bd_pins system_rstn] [get_bd_pins hls_rst/s_axi_aresetn]
connect_bd_net [get_bd_pins rst_ps8_0_99M/peripheral_reset] [get_bd_pins system_rst]
connect_bd_net [get_bd_pins versal_cips_0/fpd_cci_noc_axi0_clk] [get_bd_pins axi_noc_0/aclk0]
connect_bd_net [get_bd_pins versal_cips_0/fpd_cci_noc_axi1_clk] [get_bd_pins axi_noc_0/aclk1]
connect_bd_net [get_bd_pins versal_cips_0/fpd_cci_noc_axi2_clk] [get_bd_pins axi_noc_0/aclk2]
connect_bd_net [get_bd_pins versal_cips_0/fpd_cci_noc_axi3_clk] [get_bd_pins axi_noc_0/aclk3]
connect_bd_net [get_bd_pins versal_cips_0/pl0_ref_clk] \
  [get_bd_pins clk_freerun] [get_bd_pins pl_clk0] [get_bd_pins axi_iic_0/s_axi_aclk] [get_bd_pins axi_timer_0/s_axi_aclk] \
  [get_bd_pins hls_rst/s_axi_aclk] [get_bd_pins proc_sys_reset_0/slowest_sync_clk] \
  [get_bd_pins rst_ps8_0_99M/slowest_sync_clk] [get_bd_pins smartconnect_0/aclk] [get_bd_pins versal_cips_0/m_axi_fpd_aclk] \
  [get_bd_pins versal_cips_0/m_axi_lpd_aclk] [get_bd_pins axi_gpio_0/s_axi_aclk]
connect_bd_net [get_bd_pins versal_cips_0/pl0_resetn] [get_bd_pins pl0_resetn] [get_bd_pins rst_ps8_0_99M/dcm_locked]
connect_bd_net [get_bd_pins versal_cips_0/pl1_ref_clk] [get_bd_pins pl1_ref_clk] [get_bd_pins axi_noc_0/aclk4] [get_bd_pins axi_noc_0/aclk5]
connect_bd_net [get_bd_pins xlslice_0/Dout] [get_bd_pins gpio_io_o]
connect_bd_net [get_bd_pins xlslice_1/Dout] [get_bd_pins Dout]

current_bd_instance /
connect_bd_intf_net -intf_net CLK_IN_D_0_2 [get_bd_intf_ports aud_mclk_in] [get_bd_intf_pins util_ds_buf_2_aud/CLK_IN_D]
connect_bd_intf_net [get_bd_intf_pins gt_quad/RX0_GT_IP_Interface] [get_bd_intf_pins dp_rx_hier_0/GT_RX0]
connect_bd_intf_net [get_bd_intf_pins gt_quad/RX1_GT_IP_Interface] [get_bd_intf_pins dp_rx_hier_0/GT_RX1]
connect_bd_intf_net [get_bd_intf_pins gt_quad/RX2_GT_IP_Interface] [get_bd_intf_pins dp_rx_hier_0/GT_RX2]
connect_bd_intf_net [get_bd_intf_pins gt_quad/RX3_GT_IP_Interface] [get_bd_intf_pins dp_rx_hier_0/GT_RX3]
connect_bd_intf_net [get_bd_intf_pins dp_rx_hier_0/M_AXIS] [get_bd_intf_pins dp_tx_hier_0/S00_AXIS]
connect_bd_intf_net -intf_net S01_AXI_1 [get_bd_intf_pins dp_tx_hier_0/tx_video_MM] [get_bd_intf_pins processor_hier_0/tx_video_MM]
connect_bd_intf_net [get_bd_intf_pins gt_quad/TX0_GT_IP_Interface] [get_bd_intf_pins dp_tx_hier_0/GT_TX0]
connect_bd_intf_net [get_bd_intf_pins gt_quad/TX1_GT_IP_Interface] [get_bd_intf_pins dp_tx_hier_0/GT_TX1]
connect_bd_intf_net [get_bd_intf_pins gt_quad/TX2_GT_IP_Interface] [get_bd_intf_pins dp_tx_hier_0/GT_TX2]
connect_bd_intf_net [get_bd_intf_pins gt_quad/TX3_GT_IP_Interface] [get_bd_intf_pins dp_tx_hier_0/GT_TX3]
connect_bd_intf_net [get_bd_intf_pins dp_rx_hier_0/rx_video_MM] [get_bd_intf_pins processor_hier_0/rx_video_MM]
connect_bd_intf_net -intf_net gt_quad_base_GT_Serial [get_bd_intf_pins gt_quad/GT_Serial] [get_bd_intf_ports GT_Serial]
connect_bd_intf_net [get_bd_intf_ports CH0_DDR4_0_0] [get_bd_intf_pins processor_hier_0/CH0_DDR4_0_0]
connect_bd_intf_net [get_bd_intf_ports IIC_0] [get_bd_intf_pins processor_hier_0/IIC_0]
connect_bd_intf_net [get_bd_intf_pins dp_rx_hier_0/S00_AXI] [get_bd_intf_pins processor_hier_0/M02_AXI]
connect_bd_intf_net [get_bd_intf_pins processor_hier_0/M05_AXI_0] [get_bd_intf_pins gt_quad/AXI_LITE]
connect_bd_intf_net [get_bd_intf_pins dp_tx_hier_0/S00_AXI] [get_bd_intf_pins processor_hier_0/M09_AXI]
connect_bd_intf_net [get_bd_intf_ports refclk] [get_bd_intf_pins gt_quad/dprx_gt_ip0_diff_gt_ref_clock]
connect_bd_intf_net -intf_net sys_clk0_0_1 [get_bd_intf_ports sys_clk0_0] [get_bd_intf_pins processor_hier_0/sys_clk0_0]
connect_bd_net -net In4_1 [get_bd_pins dp_rx_hier_0/fmbuf_wr_intr] [get_bd_pins processor_hier_0/fmbuf_wr_intr]
connect_bd_net [get_bd_ports aux_rx_data_in] [get_bd_pins dp_rx_hier_0/aux_rx_data_in_0]
connect_bd_net [get_bd_ports aux_tx_data_in] [get_bd_pins dp_tx_hier_0/aux_tx_data_in]
connect_bd_net -net axi_gpio_0_gpio_io_o [get_bd_pins processor_hier_0/gpio_io_o] [get_bd_pins dp_rx_hier_0/hls_rstn]
connect_bd_net -net bufg_gt_1_usrclk [get_bd_pins gt_quad/usrclk] [get_bd_pins dp_tx_hier_0/gt_txusrclk]
connect_bd_net -net bufg_gt_usrclk [get_bd_pins gt_quad/ch0_rxusrclk] [get_bd_pins dp_rx_hier_0/gt_rxusrclk]
connect_bd_net -net clk_wizard_0_clk_out1 [get_bd_pins processor_hier_0/clk_freerun] \
  [get_bd_pins dp_tx_hier_0/clk_in1] [get_bd_pins gt_quad/s_axi_lite_clk]
connect_bd_net -net clk_wizard_1_clk_out1 [get_bd_pins processor_hier_0/pl1_ref_clk] \
  [get_bd_pins dp_rx_hier_0/video_clk_300] [get_bd_pins dp_tx_hier_0/slowest_sync_clk]
connect_bd_net [get_bd_pins clk_wizard_1/clk_out1] [get_bd_pins dp_tx_hier_0/aud_clk]
connect_bd_net -net ctl_reset_1 [get_bd_pins processor_hier_0/system_rst] [get_bd_pins dp_rx_hier_0/system_rst]
connect_bd_net -net dcm_locked_0_1 [get_bd_pins processor_hier_0/pl0_resetn] [get_bd_pins dp_rx_hier_0/dcm_locked_0]
connect_bd_net [get_bd_pins dp_rx_hier_0/Dout] [get_bd_pins clk_wizard_1/reset]
connect_bd_net [get_bd_pins dp_rx_hier_0/aud_clk_out_0] [get_bd_ports OBUF_DS_P_0]
connect_bd_net [get_bd_pins dp_rx_hier_0/aux_rx_data_en_out_n_0] [get_bd_ports aux_rx_data_en_out_n]
connect_bd_net [get_bd_pins dp_rx_hier_0/aux_rx_data_out_0] [get_bd_ports aux_rx_data_out]
connect_bd_net [get_bd_pins dp_rx_hier_0/dprxss_dp_irq] [get_bd_pins processor_hier_0/dprxss_dp_irq]
connect_bd_net [get_bd_pins dp_rx_hier_0/irq] [get_bd_pins processor_hier_0/In6]
connect_bd_net [get_bd_pins dp_rx_hier_0/lrclk_out_0] [get_bd_ports lrclk_tx]
connect_bd_net [get_bd_pins dp_rx_hier_0/peripheral_aresetn1] [get_bd_pins dp_tx_hier_0/s_axis_aresetn_stream1]
connect_bd_net [get_bd_pins dp_rx_hier_0/rx_hpd] [get_bd_ports rx_hpd]
connect_bd_net [get_bd_pins dp_rx_hier_0/sclk_out_0] [get_bd_ports sclk_tx]
connect_bd_net [get_bd_pins dp_rx_hier_0/sdata_0_out_0] [get_bd_ports sdata_tx]
connect_bd_net [get_bd_pins dp_tx_hier_0/aux_tx_data_en_out_n] [get_bd_ports aux_tx_data_en_out_n]
connect_bd_net [get_bd_pins dp_tx_hier_0/aux_tx_data_out] [get_bd_ports aux_tx_data_out]
connect_bd_net [get_bd_pins dp_tx_hier_0/lrclk_out_0] [get_bd_ports lrclk_rx]
connect_bd_net [get_bd_pins dp_tx_hier_0/sclk_out_0] [get_bd_ports sclk_rx]
connect_bd_net -net ext_reset_in_0_1 [get_bd_ports reset] \
  [get_bd_pins dp_rx_hier_0/ext_reset_in_0] [get_bd_pins dp_tx_hier_0/reset] [get_bd_pins processor_hier_0/ext_reset_in_0] \
  [get_bd_pins processor_hier_0/reset]
connect_bd_net -net gt_bufgtclr1_1 [get_bd_pins dp_tx_hier_0/tx_bufg_gt_clr] [get_bd_pins gt_quad/gt_bufgtclr1]
connect_bd_net -net gt_bufgtclr_1 [get_bd_pins dp_rx_hier_0/rx_bufg_gt_clr] [get_bd_pins gt_quad/gt_bufgtclr]
connect_bd_net -net gt_quad_base_gtpowergood [get_bd_pins gt_quad/gtpowergood] \
  [get_bd_pins dp_rx_hier_0/gt_powergood] [get_bd_pins dp_tx_hier_0/gt_powergood] [get_bd_pins processor_hier_0/gpio_io_i]
connect_bd_net [get_bd_pins gt_quad/hsclk0_lcplllock] [get_bd_pins dp_rx_hier_0/rx_pll0_locked]
connect_bd_net [get_bd_pins gt_quad/hsclk0_rplllock] [get_bd_pins dp_tx_hier_0/tx_pll0_locked]
connect_bd_net [get_bd_pins gt_quad/hsclk1_lcplllock] [get_bd_pins dp_rx_hier_0/rx_pll1_locked1]
connect_bd_net [get_bd_pins gt_quad/hsclk1_rplllock] [get_bd_pins dp_tx_hier_0/tx_pll1_locked]
connect_bd_net [get_bd_pins gt_quad/usrclk1] [get_bd_pins dp_tx_hier_0/tx_enc_clk]
connect_bd_net -net hsclk0_lcpllreset_1 [get_bd_pins dp_rx_hier_0/rx_pll0_reset] [get_bd_pins gt_quad/hsclk0_lcpllreset]
connect_bd_net -net hsclk0_rpllreset_1 [get_bd_pins dp_tx_hier_0/tx_pll0_reset] [get_bd_pins gt_quad/hsclk0_rpllreset]
connect_bd_net -net hsclk1_lcpllreset_1 [get_bd_pins dp_rx_hier_0/rx_pll1_reset] [get_bd_pins gt_quad/hsclk1_lcpllreset]
connect_bd_net -net hsclk1_rpllreset_1 [get_bd_pins dp_tx_hier_0/tx_pll1_reset] [get_bd_pins gt_quad/hsclk1_rpllreset]
connect_bd_net [get_bd_pins oddr_0/clk_out] [get_bd_ports mclk_out_rx]
connect_bd_net [get_bd_pins oddr_1/clk_out] [get_bd_ports mclk_out_tx]
connect_bd_net [get_bd_pins processor_hier_0/Dout] [get_bd_pins dp_tx_hier_0/hls_rstn]
connect_bd_net [get_bd_pins processor_hier_0/peripheral_aresetn] [get_bd_pins dp_tx_hier_0/gt_ctrl_aresetn] [get_bd_pins gt_quad/s_axi_lite_resetn]
connect_bd_net -net rst_ps8_0_99M_peripheral_aresetn [get_bd_pins processor_hier_0/system_rstn] \
  [get_bd_pins dp_rx_hier_0/system_rstn] [get_bd_pins dp_tx_hier_0/system_rstn]
connect_bd_net -net sdata_0_in_0_1 [get_bd_ports sdata_rx] [get_bd_pins dp_tx_hier_0/sdata_0_in_0]
connect_bd_net [get_bd_ports tx_hpd] [get_bd_pins dp_tx_hier_0/tx_hpd]
connect_bd_net [get_bd_pins util_ds_buf_2_aud/IBUF_DS_ODIV2] [get_bd_pins util_ds_buf_aud/BUFG_GT_I]
connect_bd_net [get_bd_pins util_ds_buf_aud/BUFG_GT_O] \
  [get_bd_pins clk_wizard_1/clk_in1] [get_bd_pins dp_rx_hier_0/aud_mclk] [get_bd_pins dp_tx_hier_0/aud_mclk] \
  [get_bd_pins oddr_0/clk_in] [get_bd_pins oddr_1/clk_in]
connect_bd_net -net v_dp_txss1_0_dptxss_dp_irq [get_bd_pins dp_tx_hier_0/dptxss_dp_irq] [get_bd_pins processor_hier_0/dptxss_dp_irq]
connect_bd_net -net v_frmbuf_rd_0_interrupt [get_bd_pins dp_tx_hier_0/frmbuf_rd_intr] [get_bd_pins processor_hier_0/frmbuf_rd_intr]
connect_bd_net [get_bd_pins xlconstant_0/dout] [get_bd_ports pwd]
connect_bd_net [get_bd_pins xlconstant_1/dout] [get_bd_pins util_ds_buf_aud/BUFG_GT_CE]
connect_bd_net -net zynq_ultra_ps_e_0_pl_clk0 [get_bd_pins processor_hier_0/pl_clk0] \
  [get_bd_pins dp_rx_hier_0/system_clk] [get_bd_pins dp_tx_hier_0/av_axi_aclk]
